# Altium schematic sheet Block Diagram.SchDoc
size A; SheetNumber: 1; SheetTotal: 10; CompanyName: Gamber-Johnson LLC; Organization: CD Cell
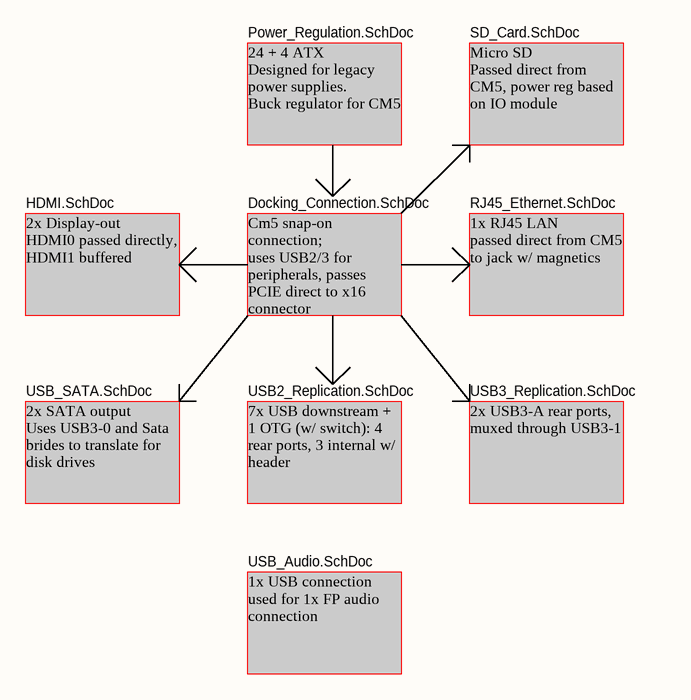
[diagram p0: Block Diagram.SchDoc]

## Sub-sheets
12VDC, 5VDC, 5VDC. 3VDC, 1.2VDC = Power_Regulation.SchDoc: no entries
12VDC, 5VDC, 5VDC. 3VDC, 1.2VDC = USB2_Replication.SchDoc: no entries
12VDC, 5VDC, 5VDC. 3VDC, 1.2VDC = Docking_Connection.SchDoc: no entries
12VDC, 5VDC, 5VDC. 3VDC, 1.2VDC = RJ45_Ethernet.SchDoc: no entries
12VDC, 5VDC, 5VDC. 3VDC, 1.2VDC = HDMI.SchDoc: no entries
12VDC, 5VDC, 5VDC. 3VDC, 1.2VDC = USB_SATA.SchDoc: no entries
12VDC, 5VDC, 5VDC. 3VDC, 1.2VDC = SD_Card.SchDoc: no entries
12VDC, 5VDC, 5VDC. 3VDC, 1.2VDC = USB3_Replication.SchDoc: no entries
12VDC, 5VDC, 5VDC. 3VDC, 1.2VDC = USB_Audio.SchDoc: no entries

## Notes on the sheet
- 24 + 4 ATX
  Designed for legacy power supplies.
  Buck regulator for CM5
- Micro SD
  Passed direct from CM5, power reg based on IO module
- 2x Display-out
  HDMI0 passed directly, HDMI1 buffered
- Cm5 snap-on connection;
  uses USB2/3 for peripherals, passes PCIE direct to x16 connector
- 1x RJ45 LAN
  passed direct from CM5 to jack w/ magnetics
- 2x SATA output
  Uses USB3-0 and Sata brides to translate for disk drives
- 7x USB downstream + 1 OTG (w/ switch): 4 rear ports, 3 internal w/ header
- 2x USB3-A rear ports, muxed through USB3-1
- 1x USB connection used for 1x FP audio connection
- REV
- REVISIONS
- DATE
- DESCRIPTION
- BY
- UNLESS OTHERWISE SPECIFIED, DRAWING DEFINITIONS AND TOLERANCES SHALL BE FOUND UNDER SUPPLIER STANDARDS SS-001. THIS PART AND ALL COMPONENTS OF IT MUST BE RoHS & REACH COMPLIANT. A CERTIFICATE OF COMPLIANCE MUST BE PROVIDED UPON REQUEST.
- ALL INFORMATION ON THIS DOCUMENT IS THE SOLE PROPERTY OF GAMBER-JOHNSON AND SHALL NOT BE COPIED, REPRODUCED, USED OR DISCLOSED IN WHOLE OR IN PART WITHOUT THE WRITTEN CONSENT OF GAMBER-JOHNSON
- TOLERANCES
  .00 ± .060
  .000 ± .020
  .0000 ± .005
  ANGELS ± 1°
- DRAWN BY:
- PROJECT NUMBER:
- SHEET TITLE:
- SHEET
- OF
- DATE:
- LOCATION:
- ASSEMBLY NUMBER
- SIZE
- GAMBER-JOHNSON LLC
  5001 Joerns Dr
  STEVENS POINT, WI 54481
  +1 (715) 344-5209
- A